# EAGLE design NintendoDualLCD (EAGLE 6.5.0)
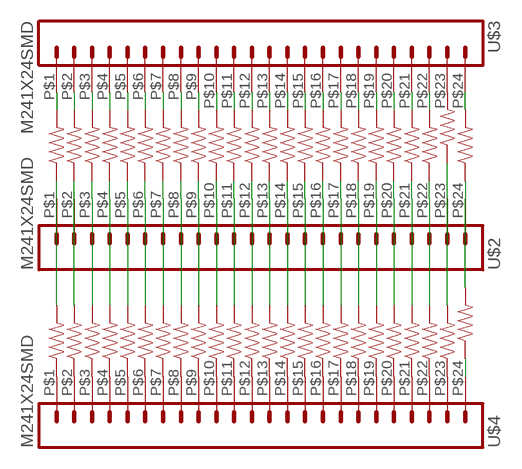
[diagram p0: schematic, sheet 1]

## Parts
R1  100  RESISTOR0603-RES  [0603-RES]
R2  100  RESISTOR0603-RES  [0603-RES]
R3  100  RESISTOR0603-RES  [0603-RES]
R4  100  RESISTOR0603-RES  [0603-RES]
R5  100  RESISTOR0603-RES  [0603-RES]
R6  100  RESISTOR0603-RES  [0603-RES]
R7  100  RESISTOR0603-RES  [0603-RES]
R8  100  RESISTOR0603-RES  [0603-RES]
R9  100  RESISTOR0603-RES  [0603-RES]
R10  100  RESISTOR0603-RES  [0603-RES]
R11  100  RESISTOR0603-RES  [0603-RES]
R12  100  RESISTOR0603-RES  [0603-RES]
R13  100  RESISTOR0603-RES  [0603-RES]
R14  100  RESISTOR0603-RES  [0603-RES]
R15  100  RESISTOR0603-RES  [0603-RES]
R16  100  RESISTOR0603-RES  [0603-RES]
R17  100  RESISTOR0603-RES  [0603-RES]
R18  100  RESISTOR0603-RES  [0603-RES]
R19  100  RESISTOR0603-RES  [0603-RES]
R20  100  RESISTOR0603-RES  [0603-RES]
R21  100  RESISTOR0603-RES  [0603-RES]
R22  100  RESISTOR0603-RES  [0603-RES]
R23  100  RESISTOR0603-RES  [0603-RES]
R24  100  RESISTOR0603-RES  [0603-RES]
R25  100  RESISTOR0603-RES  [0603-RES]
R26  100  RESISTOR0603-RES  [0603-RES]
R27  100  RESISTOR0603-RES  [0603-RES]
R28  100  RESISTOR0603-RES  [0603-RES]
R29  100  RESISTOR0603-RES  [0603-RES]
R30  100  RESISTOR0603-RES  [0603-RES]
R31  100  RESISTOR0603-RES  [0603-RES]
R32  100  RESISTOR0603-RES  [0603-RES]
R33  100  RESISTOR0603-RES  [0603-RES]
R34  100  RESISTOR0603-RES  [0603-RES]
R35  100  RESISTOR0603-RES  [0603-RES]
R36  100  RESISTOR0603-RES  [0603-RES]
R37  100  RESISTOR0603-RES  [0603-RES]
R38  100  RESISTOR0603-RES  [0603-RES]
R39  100  RESISTOR0603-RES  [0603-RES]
R40  100  RESISTOR0603-RES  [0603-RES]
R41  100  RESISTOR0603-RES  [0603-RES]
R42  100  RESISTOR0603-RES  [0603-RES]
R43  100  RESISTOR0603-RES  [0603-RES]
R44  100  RESISTOR0603-RES  [0603-RES]
R45  100  RESISTOR0603-RES  [0603-RES]
R46  100  RESISTOR0603-RES  [0603-RES]
R47  100  RESISTOR0603-RES  [0603-RES]
R48  100  RESISTOR0603-RES  [0603-RES]
U$2  M241X24SMD  [1X24SMD]
U$3  M241X24SMD  [1X24SMD]
U$4  M241X24SMD  [1X24SMD]

## Nets
N$1: R1.1 R23.2 U$2.P$1
N$2: R2.1 R24.2 U$2.P$2
N$3: R3.1 R25.2 U$2.P$3
N$4: R4.1 R26.2 U$2.P$4
N$5: R5.1 R27.2 U$2.P$5
N$6: R6.1 R28.2 U$2.P$6
N$7: R7.1 R29.2 U$2.P$7
N$8: R8.1 R30.2 U$2.P$8
N$9: R9.1 R31.2 U$2.P$9
N$10: R10.1 R32.2 U$2.P$10
N$11: R11.1 R34.2 U$2.P$11
N$12: R12.1 R35.2 U$2.P$12
N$13: R13.1 R36.2 U$2.P$13
N$14: R14.1 R37.2 U$2.P$14
N$15: R15.1 R38.2 U$2.P$15
N$16: R16.1 R39.2 U$2.P$16
N$17: R17.1 R40.2 U$2.P$17
N$18: R18.1 R41.2 U$2.P$18
N$19: R19.1 R42.2 U$2.P$19
N$20: R20.1 R43.2 U$2.P$20
N$21: R1.2 U$3.P$1
N$22: R2.2 U$3.P$2
N$23: R3.2 U$3.P$3
N$24: R4.2 U$3.P$4
N$25: R5.2 U$3.P$5
N$26: R6.2 U$3.P$6
N$27: R7.2 U$3.P$7
N$28: R8.2 U$3.P$8
N$29: R9.2 U$3.P$9
N$30: R10.2 U$3.P$10
N$31: R11.2 U$3.P$11
N$32: R12.2 U$3.P$12
N$33: R13.2 U$3.P$13
N$34: R14.2 U$3.P$14
N$35: R15.2 U$3.P$15
N$36: R16.2 U$3.P$16
N$37: R17.2 U$3.P$17
N$38: R18.2 U$3.P$18
N$39: R19.2 U$3.P$19
N$40: R20.2 U$3.P$20
N$41: R21.1 R44.2 U$2.P$21
N$42: R21.2 U$3.P$21
N$43: R22.1 R45.2 U$2.P$22
N$44: R22.2 U$3.P$22
N$45: R25.1 U$4.P$3
N$46: R26.1 U$4.P$4
N$47: R27.1 U$4.P$5
N$48: R28.1 U$4.P$6
N$49: R29.1 U$4.P$7
N$50: R30.1 U$4.P$8
N$51: R31.1 U$4.P$9
N$52: R32.1 U$4.P$10
N$53: R34.1 U$4.P$11
N$54: R36.1 U$4.P$13
N$55: R37.1 U$4.P$14
N$56: R38.1 U$4.P$15
N$57: R39.1 U$4.P$16
N$58: R40.1 U$4.P$17
N$59: R41.1 U$4.P$18
N$60: R42.1 U$4.P$19
N$61: R43.1 U$4.P$20
N$62: R44.1 U$4.P$21
N$63: R45.1 U$4.P$22
N$64: R23.1 U$4.P$1
N$65: R24.1 U$4.P$2
N$66: R35.1 U$4.P$12
N$67: R46.2 U$3.P$23
N$68: R33.1 U$4.P$23
N$69: R47.1 R48.2 U$2.P$24
N$70: R48.1 U$4.P$24
N$71: R33.2 R46.1 U$2.P$23
N$72: R47.2 U$3.P$24

## Library data of the parts
R1-R48 = SparkFun-Passives:RESISTOR: Resistor Basic schematic elements and footprints for 0603, 1206, and PTH resistors.
U$2-U$4 = SparkFun-Connectors:M24: 1x24 .1" header

## Board
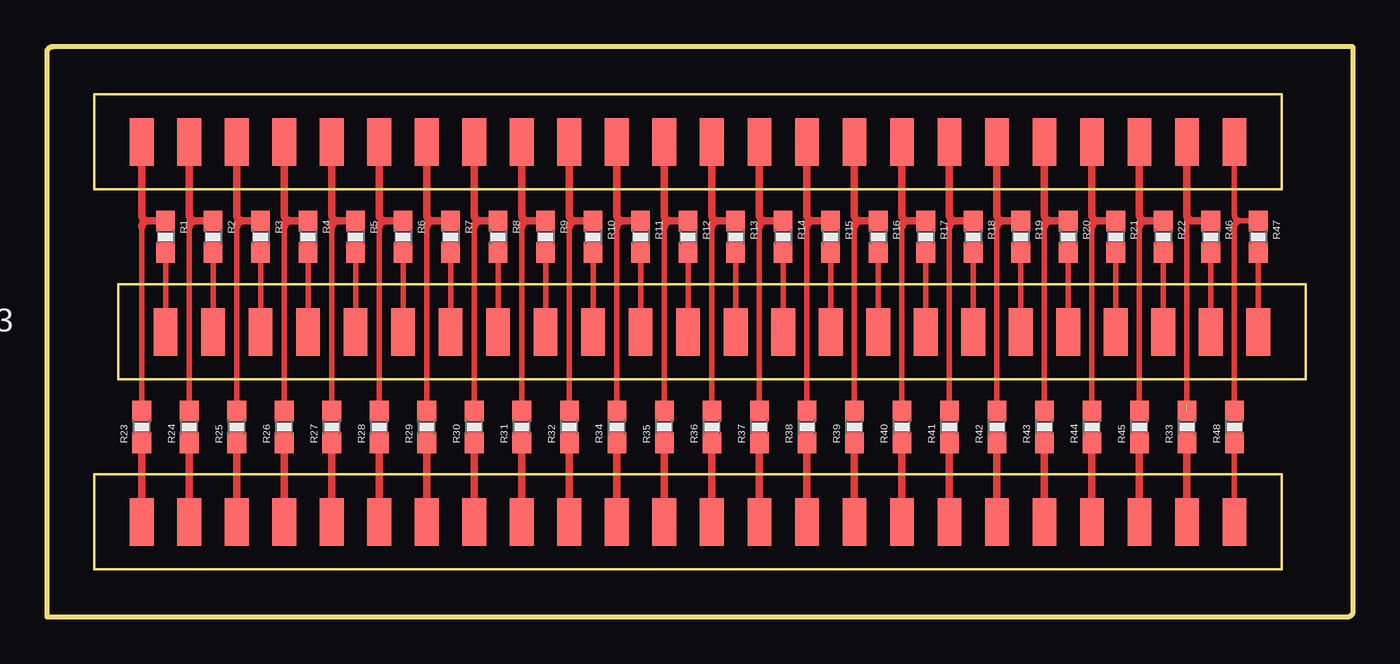
[diagram p1: board, top side]

Size 69.85 x 30.48 mm. Coordinates in mm from the lower left corner, seen from the top.
Outline: 0,0 69.53,0 arc90 69.85,0.32 69.85,30.48 0.32,30.48 arc90 0,30.16 0,0
Copper layers (1*16): Top 0.035mm / dielectric 1.5mm / Bottom 0.035mm
Design rules "default": minimum track width 10mil, minimum drill 0.6mm, track to track 8mil, track to pad 8mil, pad to pad 8mil, via to via 8mil, smd to smd 8mil, copper to edge 40mil, drill to drill 8mil, minimum pad ring 10mil, minimum via ring 8mil, stop-mask expansion 4mil, vias tented up to drill 0mil, thermal gap 10mil

### Footprints (pad centres in the part's own frame; a part is rotated, then mirrored left to right if it is on the bottom)
0603-RES = smd 1.1 x 1: 1 -0.85,0; 2 0.85,0
1X24SMD = smd 1.27 x 2.54: P$1 1.27,0; P$2 3.81,0; P$3 6.35,0; P$4 8.89,0; P$5 11.43,0; P$6 13.97,0; P$7 16.51,0; P$8 19.05,0; P$9 21.59,0; P$10 24.13,0; P$11 26.67,0; P$12 29.21,0; P$13 31.75,0; P$14 34.29,0; P$15 36.83,0; P$16 39.37,0; P$17 41.91,0; P$18 44.45,0; P$19 46.99,0; P$20 49.53,0; P$21 52.07,0; P$22 54.61,0; P$23 57.15,0; P$24 59.69,0

### Placement (x,y rotation side)
R1  6.35,20.32 270 top
R2  8.89,20.32 270 top
R3  11.43,20.32 270 top
R4  13.97,20.32 270 top
R5  16.51,20.32 270 top
R6  19.05,20.32 270 top
R7  21.59,20.32 270 top
R8  24.13,20.32 270 top
R9  26.67,20.32 270 top
R10  29.21,20.32 270 top
R11  31.75,20.32 270 top
R12  34.29,20.32 270 top
R13  36.83,20.32 270 top
R14  39.37,20.32 270 top
R15  41.91,20.32 270 top
R16  44.45,20.32 270 top
R17  46.99,20.32 270 top
R18  49.53,20.32 270 top
R19  52.07,20.32 270 top
R20  54.61,20.32 270 top
R21  57.15,20.32 270 top
R22  59.69,20.32 270 top
R23  5.08,10.16 90 top
R24  7.62,10.16 90 top
R25  10.16,10.16 90 top
R26  12.7,10.16 90 top
R27  15.24,10.16 90 top
R28  17.78,10.16 90 top
R29  20.32,10.16 90 top
R30  22.86,10.16 90 top
R31  25.4,10.16 90 top
R32  27.94,10.16 90 top
R33  60.96,10.16 90 top
R34  30.48,10.16 90 top
R35  33.02,10.16 90 top
R36  35.56,10.16 90 top
R37  38.1,10.16 90 top
R38  40.64,10.16 90 top
R39  43.18,10.16 90 top
R40  45.72,10.16 90 top
R41  48.26,10.16 90 top
R42  50.8,10.16 90 top
R43  53.34,10.16 90 top
R44  55.88,10.16 90 top
R45  58.42,10.16 90 top
R46  62.23,20.32 270 top
R47  64.77,20.32 270 top
R48  63.5,10.16 90 top
U$2  3.81,25.4 0 top
U$3  5.08,15.24 0 top
U$4  3.81,5.08 0 top

### Tracks (layer width: path | path; a pad name or v marks a point on that pad's centre or on a via)
N$1
  Top 0.305: 5.08,20.85 R23.2
  Top 0.406: 5.4,21.17 arc90 5.08,20.85 | R1.1 5.4,21.17 | 5.4,21.17 arc-90 5.08,21.49 U$2.P$1
N$2
  Top 0.305: 7.62,20.85 R24.2
  Top 0.406: 7.94,21.17 arc90 7.62,20.85 | R2.1 7.94,21.17 | 7.94,21.17 arc-90 7.62,21.49 U$2.P$2
N$3
  Top 0.305: 10.16,20.85 R25.2
  Top 0.406: 10.48,21.17 arc90 10.16,20.85 | R3.1 10.48,21.17 | 10.48,21.17 arc-90 10.16,21.49 U$2.P$3
N$4
  Top 0.305: 12.7,20.85 R26.2
  Top 0.406: 13.02,21.17 arc90 12.7,20.85 | R4.1 13.02,21.17 | 13.02,21.17 arc-90 12.7,21.49 U$2.P$4
N$5
  Top 0.305: 15.24,20.85 R27.2
  Top 0.406: 15.56,21.17 arc90 15.24,20.85 | R5.1 15.56,21.17 | 15.56,21.17 arc-90 15.24,21.49 U$2.P$5
N$6
  Top 0.305: 17.78,20.85 R28.2
  Top 0.406: 18.1,21.17 arc90 17.78,20.85 | R6.1 18.1,21.17 | 18.1,21.17 arc-90 17.78,21.49 U$2.P$6
N$7
  Top 0.305: 20.32,20.85 R29.2
  Top 0.406: 20.64,21.17 arc90 20.32,20.85 | R7.1 20.64,21.17 | 20.64,21.17 arc-90 20.32,21.49 U$2.P$7
N$8
  Top 0.305: 22.86,20.85 R30.2
  Top 0.406: 23.18,21.17 arc90 22.86,20.85 | R8.1 23.18,21.17 | 23.18,21.17 arc-90 22.86,21.49 U$2.P$8
N$9
  Top 0.305: 25.4,20.85 R31.2
  Top 0.406: 25.72,21.17 arc90 25.4,20.85 | R9.1 25.72,21.17 | 25.72,21.17 arc-90 25.4,21.49 U$2.P$9
N$10
  Top 0.305: 27.94,20.85 R32.2
  Top 0.406: 28.26,21.17 arc90 27.94,20.85 | R10.1 28.26,21.17 | 28.26,21.17 arc-90 27.94,21.49 U$2.P$10
N$11
  Top 0.305: 30.48,20.85 R34.2
  Top 0.406: 30.8,21.17 arc90 30.48,20.85 | R11.1 30.8,21.17 | 30.8,21.17 arc-90 30.48,21.49 U$2.P$11
N$12
  Top 0.305: 33.02,20.85 R35.2
  Top 0.406: 33.34,21.17 arc90 33.02,20.85 | R12.1 33.34,21.17 | 33.34,21.17 arc-90 33.02,21.49 U$2.P$12
N$13
  Top 0.305: 35.56,20.85 R36.2
  Top 0.406: 35.88,21.17 arc90 35.56,20.85 | R13.1 35.88,21.17 | 35.88,21.17 arc-90 35.56,21.49 U$2.P$13
N$14
  Top 0.305: 38.1,20.85 R37.2
  Top 0.406: 38.42,21.17 arc90 38.1,20.85 | R14.1 38.42,21.17 | 38.42,21.17 arc-90 38.1,21.49 U$2.P$14
N$15
  Top 0.305: 40.64,20.85 R38.2
  Top 0.406: 40.96,21.17 arc90 40.64,20.85 | R15.1 40.96,21.17 | 40.96,21.17 arc-90 40.64,21.49 U$2.P$15
N$16
  Top 0.305: 43.18,20.85 R39.2
  Top 0.406: 43.5,21.17 arc90 43.18,20.85 | R16.1 43.5,21.17 | 43.5,21.17 arc-90 43.18,21.49 U$2.P$16
N$17
  Top 0.305: 45.72,20.85 R40.2
  Top 0.406: 46.04,21.17 arc90 45.72,20.85 | R17.1 46.04,21.17 | 46.04,21.17 arc-90 45.72,21.49 U$2.P$17
N$18
  Top 0.305: 48.26,20.85 R41.2
  Top 0.406: 48.58,21.17 arc90 48.26,20.85 | R18.1 48.58,21.17 | 48.58,21.17 arc-90 48.26,21.49 U$2.P$18
N$19
  Top 0.305: 50.8,20.85 R42.2
  Top 0.406: 51.12,21.17 arc90 50.8,20.85 | R19.1 51.12,21.17 | 51.12,21.17 arc-90 50.8,21.49 U$2.P$19
N$20
  Top 0.305: 53.34,20.85 R43.2
  Top 0.406: 53.66,21.17 arc90 53.34,20.85 | R20.1 53.66,21.17 | 53.66,21.17 arc-90 53.34,21.49 U$2.P$20
N$21
  Top 0.305: U$3.P$1 R1.2
N$22
  Top 0.305: R2.2 U$3.P$2
N$23
  Top 0.305: U$3.P$3 R3.2
N$24
  Top 0.305: U$3.P$4 R4.2
N$25
  Top 0.305: R5.2 U$3.P$5
N$26
  Top 0.305: U$3.P$6 R6.2
N$27
  Top 0.305: R7.2 U$3.P$7
N$28
  Top 0.305: R8.2 U$3.P$8
N$29
  Top 0.305: R9.2 U$3.P$9
N$30
  Top 0.305: R10.2 U$3.P$10
N$31
  Top 0.305: R11.2 U$3.P$11
N$32
  Top 0.305: R12.2 U$3.P$12
N$33
  Top 0.305: R13.2 U$3.P$13
N$34
  Top 0.305: R14.2 U$3.P$14
N$35
  Top 0.305: R15.2 U$3.P$15
N$36
  Top 0.305: R16.2 U$3.P$16
N$37
  Top 0.305: R17.2 U$3.P$17
N$38
  Top 0.305: R18.2 U$3.P$18
N$39
  Top 0.305: R19.2 U$3.P$19
N$40
  Top 0.305: R20.2 U$3.P$20
N$41
  Top 0.305: 55.88,20.85 R44.2
  Top 0.406: 56.2,21.17 arc90 55.88,20.85 | R21.1 56.2,21.17 | 56.2,21.17 arc-90 55.88,21.49 U$2.P$21
N$42
  Top 0.305: R21.2 U$3.P$21
N$43
  Top 0.305: 58.42,20.85 R45.2
  Top 0.406: 58.74,21.17 arc90 58.42,20.85 | R22.1 58.74,21.17 | 58.74,21.17 arc-90 58.42,21.49 U$2.P$22
N$44
  Top 0.305: R22.2 U$3.P$22
N$45
  Top 0.406: R25.1 U$4.P$3
N$46
  Top 0.406: R26.1 U$4.P$4
N$47
  Top 0.406: R27.1 U$4.P$5
N$48
  Top 0.406: R28.1 U$4.P$6
N$49
  Top 0.406: R29.1 U$4.P$7
N$50
  Top 0.406: R30.1 U$4.P$8
N$51
  Top 0.406: R31.1 U$4.P$9
N$52
  Top 0.406: R32.1 U$4.P$10
N$53
  Top 0.406: R34.1 U$4.P$11
N$54
  Top 0.406: R36.1 U$4.P$13
N$55
  Top 0.406: R37.1 U$4.P$14
N$56
  Top 0.406: R38.1 U$4.P$15
N$57
  Top 0.406: R39.1 U$4.P$16
N$58
  Top 0.406: R40.1 U$4.P$17
N$59
  Top 0.406: R41.1 U$4.P$18
N$60
  Top 0.406: R42.1 U$4.P$19
N$61
  Top 0.406: R43.1 U$4.P$20
N$62
  Top 0.406: R44.1 U$4.P$21
N$63
  Top 0.406: R45.1 U$4.P$22
N$64
  Top 0.406: R23.1 U$4.P$1
N$65
  Top 0.406: R24.1 U$4.P$2
N$66
  Top 0.406: R35.1 U$4.P$12
N$67
  Top 0.305: R46.2 U$3.P$23
N$68
  Top 0.406: R33.1 U$4.P$23
N$69
  Top 0.305: R48.2 63.5,20.85 arc-90 63.82,21.17 | U$2.P$24 63.5,21.49 arc90 63.82,21.17 | 63.82,21.17 R47.1
N$70
  Top 0.305: R48.1 U$4.P$24
N$71  (1 unrouted)
  Top 0.305: 60.96,11.43 60.96,21.59
  Top 0.406: R46.1 61.28,21.17 arc-90 60.96,21.49 60.96,21.59 U$2.P$23
N$72
  Top 0.305: U$3.P$24 R47.2